# EAGLE design SubClockFix (EAGLE 7.7.0)
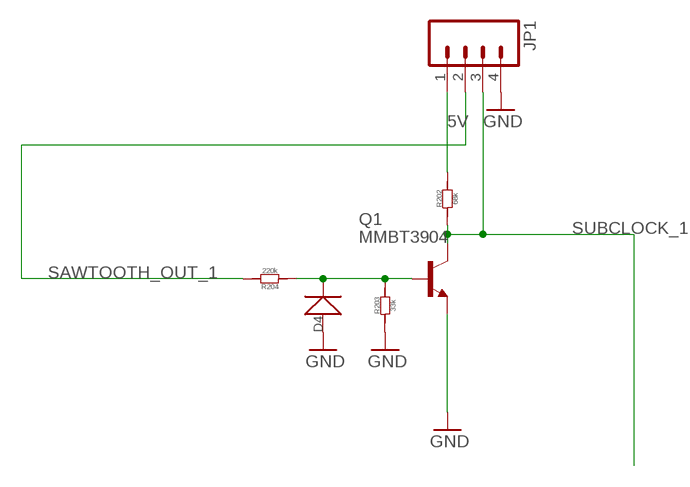
[diagram p0: schematic, sheet 1]

## Parts
D4  D-SMA  [DO-214AC]
JP1  M04PTH  [1X04]
Q1  MMBT3904  MMBT3904LT1-NPN-SOT23-BEC  [SOT23-BEC]
R202  68k  R-0603  [R0603]
R203  33k  R-0603  [R0603]
R204  220k  R-0603  [R0603]

## Nets
5V [power]: JP1.1 R202.2
GND [power]: D4.1(+) JP1.4 Q1.E R203.1
N$149: D4.2(-) Q1.B R203.2 R204.1
SAWTOOTH_OUT_1: JP1.2 R204.2
SUBCLOCK_1: JP1.3 Q1.C R202.1

## Library data of the parts
D4 = OPL:D*: DIODE
JP1 = SparkFun-Connectors:M04: Header 4 Standard 4-pin 0.1" header. Use with straight break away headers (SKU : PRT-00116), right angle break away headers (PRT-00553), swiss pins (PRT-00743), machine pins (PRT-00117), and female headers (PRT-00115). Molex polarized connector foot print use with SKU : PRT-08231 with associated crimp pins and housings. 1MM SMD Version SKU: PRT-10208
Q1 = transistor:*-NPN-: NPN Transistror BF959 corrected 2008.03.06; MF: NXP; MPN: PMBT3904,215; OC_FARNELL: 2336795
R202-R204 = OPL:R*

## Net classes
0 default: width 0.305 mm
1 power: width 0.508 mm

## Board
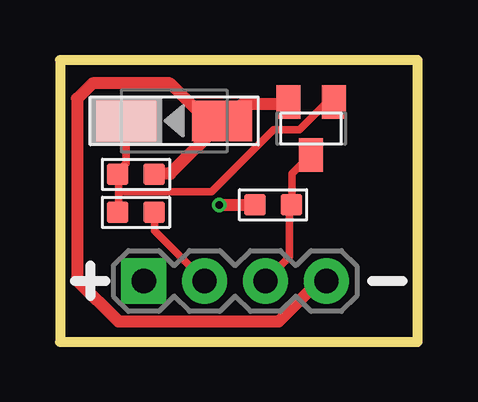
[diagram p1: board, top side]
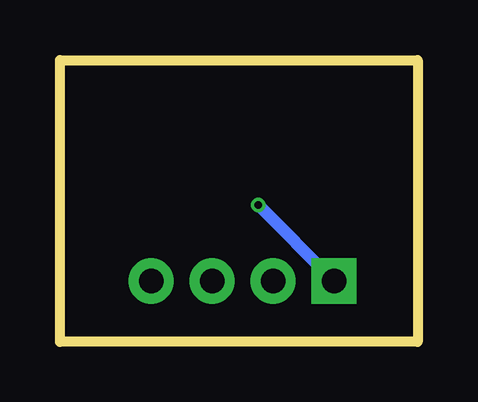
[diagram p2: board, bottom side, seen from below]

Size 14.92 x 11.75 mm. Coordinates in mm from the lower left corner, seen from the top.
Outline: 0,11.75 0,0 14.92,0 14.92,11.75 0,11.75
Copper layers (1*16): Top 0.035mm / dielectric 1.5mm / Bottom 0.035mm
Design rules "dirt_cheap_dirty_boards.v1": minimum track width 5mil, minimum drill 12mil, track to track 5mil, track to pad 5mil, pad to pad 5mil, via to via 5mil, smd to smd 0mil, copper to edge 10mil, drill to drill 10mil, minimum pad ring 10mil, minimum via ring 6mil, stop-mask expansion 2mil, vias tented up to drill 25mil, thermal gap 10mil

### Footprints (pad centres in the part's own frame; a part is rotated, then mirrored left to right if it is on the bottom)
DO-214AC = smd 2.5 x 1.7: 1 -2,0; 2 2,0
1X04 = drill 1.016 pad 1.88 square: 1 0,0 | drill 1.016 pad 1.88: 2 2.54,0; 3 5.08,0; 4 7.62,0
SOT23-BEC = smd 1 x 1.4: B -0.95,-1.1; C 0,1.1; E 0.95,-1.1
R0603 = smd 0.889 x 0.889: 1 -0.762,0; 2 0.762,0

### Placement (x,y rotation side)
D4  4.76,9.21 180 top
JP1  3.49,2.54 0 top
Q1  10.48,8.89 180 top
R202  8.89,5.71 180 top
R203  3.18,6.98 180 top
R204  3.18,5.4 0 top

### Tracks (layer width: path | path; a pad name or v marks a point on that pad's centre or on a via)
5V  (via drill 0.3)
  Top 0.508: v6.65,5.71 8.05,5.71 R202.2
  Bottom 0.508: v6.65,5.71 3.52,2.58 JP1.1
GND
  Top 0.508: R203.1 3.95,7 4.6,7 6.76,9.16 D4.1 | Q1.E 9.46,9.92 7.62,9.92 6.97,9.27 D4.1 | JP1.4 11.07,2.47 10.74,2.47 9.13,0.86 2.44,0.86 0.72,2.58 0.72,10.14 1.36,10.78 4.59,10.78 6.32,9.05 D4.1
N$149
  Top 0.305: 2.44,6.25 2.44,6.9 R203.2 2.44,7.11 2.76,7.44 2.76,9.16 D4.2 | 2.44,6.25 2.44,5.49 R204.1 | 2.44,6.25 6.32,6.25 8.92,8.84 9.99,8.84 11.07,9.92 11.4,9.92 Q1.B
SAWTOOTH_OUT_1
  Top 0.305: R204.2 3.95,5.38 3.95,4.63 6,2.58 JP1.2
SUBCLOCK_1
  Top 0.305: Q1.C 10.43,7.76 9.67,7 9.67,5.82 R202.1 9.56,5.6 9.56,3.55 8.59,2.58 JP1.3